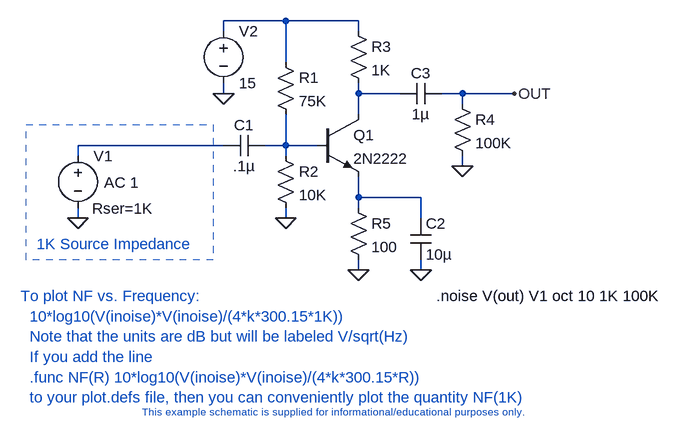
[diagram p0: schematic NoiseFigure.asc]
NoiseFigure.asc, the LTspice schematic file:
Version 4
SHEET 1 3088 1688
WIRE 1888 912 1792 912
WIRE 2000 912 1888 912
WIRE 1792 928 1792 912
WIRE 2000 928 2000 912
WIRE 1888 976 1888 912
WIRE 1792 1024 1792 1008
WIRE 2000 1024 2000 1008
WIRE 2064 1024 2000 1024
WIRE 2160 1024 2128 1024
WIRE 2240 1024 2160 1024
WIRE 2160 1040 2160 1024
WIRE 2000 1056 2000 1024
WIRE 1792 1104 1568 1104
WIRE 1888 1104 1888 1056
WIRE 1888 1104 1856 1104
WIRE 1936 1104 1888 1104
WIRE 1568 1120 1568 1104
WIRE 1888 1120 1888 1104
WIRE 2160 1136 2160 1120
WIRE 2000 1184 2000 1152
WIRE 2096 1184 2000 1184
WIRE 2000 1200 2000 1184
WIRE 1568 1216 1568 1200
WIRE 1888 1216 1888 1200
WIRE 2096 1216 2096 1184
WIRE 2000 1296 2000 1280
WIRE 2096 1296 2096 1280
FLAG 1792 1024 0
FLAG 1568 1216 0
FLAG 2240 1024 OUT
FLAG 2000 1296 0
FLAG 1888 1216 0
FLAG 2096 1296 0
FLAG 2160 1136 0
SYMBOL voltage 1792 912 R0
SYMATTR InstName V2
SYMATTR Value 15
SYMBOL npn 1936 1056 R0
SYMATTR InstName Q1
SYMATTR Value 2N2222
SYMBOL res 1984 912 R0
SYMATTR InstName R3
SYMATTR Value 1K
SYMBOL res 1984 1184 R0
SYMATTR InstName R5
SYMATTR Value 100
SYMBOL res 1872 960 R0
SYMATTR InstName R1
SYMATTR Value 75K
SYMBOL res 1872 1104 R0
SYMATTR InstName R2
SYMATTR Value 10K
SYMBOL cap 1856 1088 R90
WINDOW 0 0 32 VBottom 2
WINDOW 3 32 32 VTop 2
SYMATTR InstName C1
SYMATTR Value .1µ
SYMBOL cap 2080 1216 R0
SYMATTR InstName C2
SYMATTR Value 10µ
SYMBOL res 2144 1024 R0
SYMATTR InstName R4
SYMATTR Value 100K
SYMBOL cap 2128 1008 R90
WINDOW 0 0 32 VBottom 2
WINDOW 3 32 32 VTop 2
SYMATTR InstName C3
SYMATTR Value 1µ
SYMBOL voltage 1568 1104 R0
WINDOW 123 40 57 Left 2
WINDOW 39 22 97 Left 2
SYMATTR Value2 AC 1
SYMATTR SpiceLine Rser=1K
SYMATTR InstName V1
SYMATTR Value ""
TEXT 2120 1336 Left 2 !.noise V(out) V1 oct 10 1K 100K
TEXT 1480 1336 Left 2 ;To plot NF vs. Frequency:\n  10*log10(V(inoise)*V(inoise)/(4*k*300.15*1K))\n  Note that the units are dB but will be labeled V/sqrt(Hz)\n  If you add the line\n  .func NF(R) 10*log10(V(inoise)*V(inoise)/(4*k*300.15*R))\n  to your plot.defs file, then you can conveniently plot the quantity NF(1K)
TEXT 1624 1240 Top 2 ;1K Source Impedance
TEXT 1952 1504 Top 1 ;This example schematic is supplied for informational/educational purposes only.
RECTANGLE Normal 1776 1280 1488 1072 2

The netlist it stands for:
* NoiseFigure.asc
V2 N001 0 15
Q1 N002 N004 N005 0 2N2222
R3 N001 N002 1K
R5 N005 0 100
R1 N001 N004 75K
R2 N004 0 10K
C1 N004 N003 .1µ
C2 N005 0 10µ
R4 OUT 0 100K
C3 OUT N002 1µ
V1 N003 0 AC 1 Rser=1K
.model NPN NPN
.model PNP PNP
.lib standard.bjt
.noise V(out) V1 oct 10 1K 100K
* To plot NF vs. Frequency:
*   10*log10(V(inoise)*V(inoise)/(4*k*300.15*1K))
*   Note that the units are dB but will be labeled V/sqrt(Hz)
*   If you add the line
*   .func NF(R) 10*log10(V(inoise)*V(inoise)/(4*k*300.15*R))
*   to your plot.defs file, then you can conveniently plot the quantity NF(1K)
* 1K Source Impedance
* This example schematic is supplied for informational/educational purposes only.
.backanno
.end